# Altium schematic sheet board.SchDoc
size A4
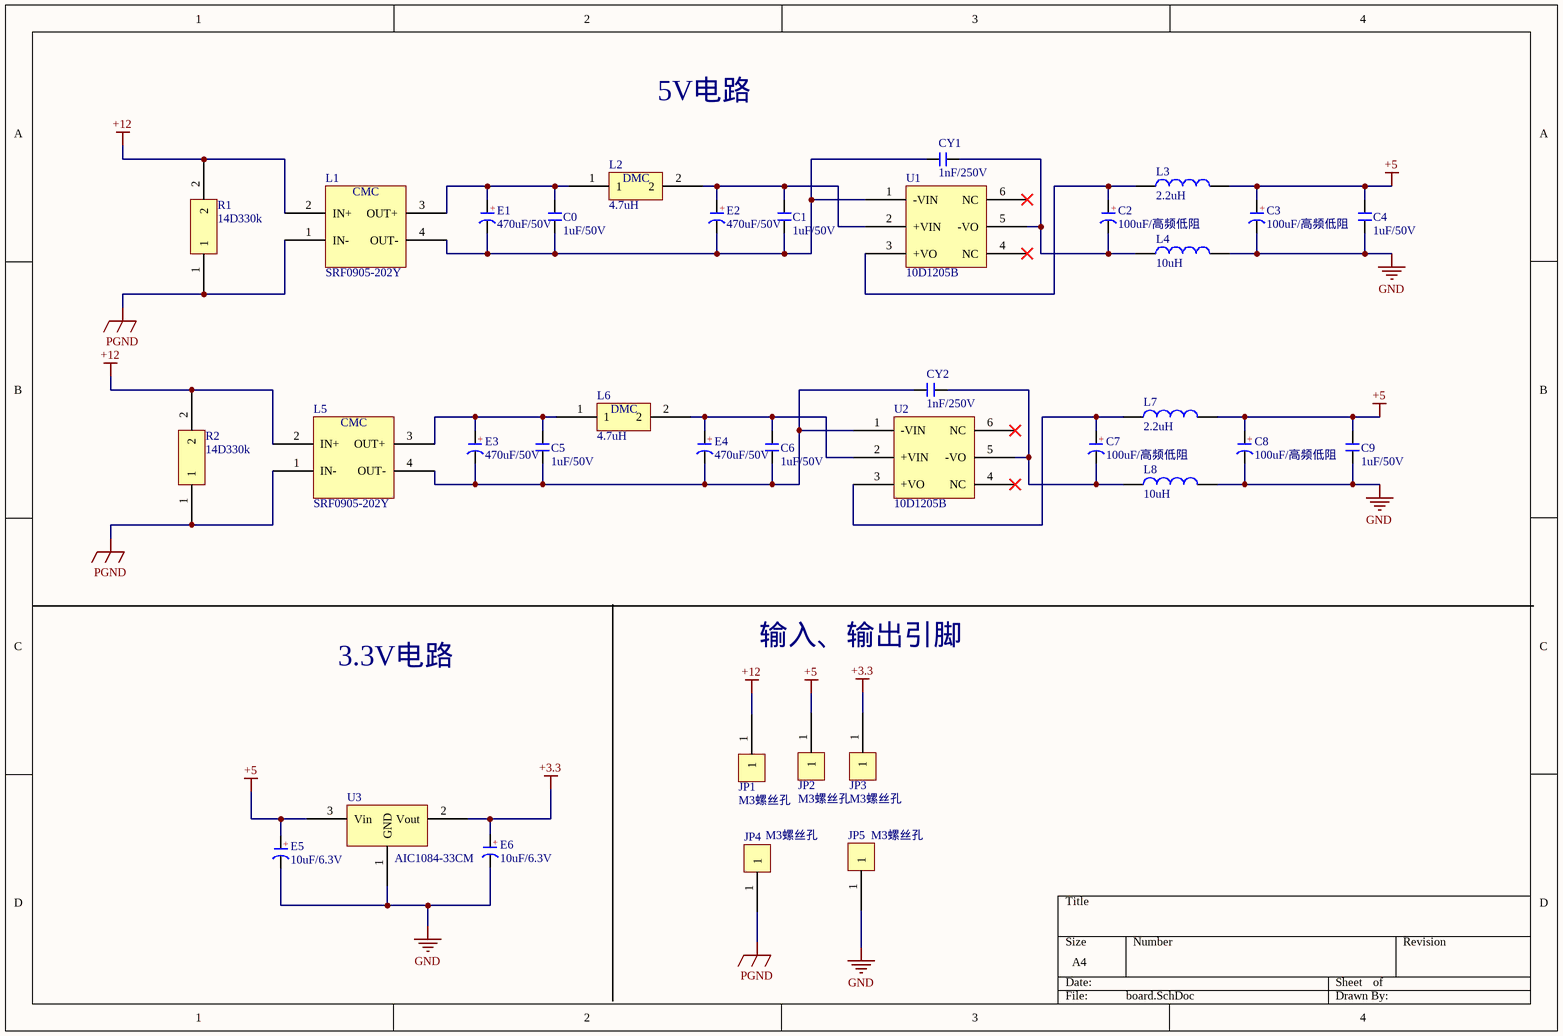
[diagram p0: board.SchDoc]

## Parts
C0  1uF/50V  [CC 2.2*5]
C1  1uF/50V  [CC 2.2*5]
C2  100uF/高频低阻  [CAP 3.5*8*11.5-H - GD]
C3  100uF/高频低阻  [CAP 3.5*8*11.5-H - GD]
C4  1uF/50V  [CC 2.2*5]
C5  1uF/50V  [CC 2.2*5]
C6  1uF/50V  [CC 2.2*5]
C7  100uF/高频低阻  [CAP 3.5*8*11.5-H - GD]
C8  100uF/高频低阻  [CAP 3.5*8*11.5-H - GD]
C9  1uF/50V  [CC 2.2*5]
CY1  1nF/250V  [CY 7.5*10*4]
CY2  1nF/250V  [CY 7.5*10*4]
E1  470uF/50V  [CM G(12.5*13.5)]
E2  470uF/50V  [CM G(12.5*13.5)]
E3  470uF/50V  [CM G(12.5*13.5)]
E4  470uF/50V  [CM G(12.5*13.5)]
E5  10uF/6.3V  [CD A(3216)]
E6  10uF/6.3V  [CD A(3216)]
JP1  M3螺丝孔  [M3x15_N]
JP2  M3螺丝孔  [M3x15_N]
JP3  M3螺丝孔  [M3x15_N]
JP4  M3螺丝孔  [M3x15_N]
JP5  M3螺丝孔  [M3x15_N]
L1  SRF0905-202Y  [SRF0905]
L2  4.7uH  [NR5020]
L3  2.2uH  [L 0805]
L4  10uH  [L 0805]
L5  SRF0905-202Y  [SRF0905]
L6  4.7uH  [NR5020]
L7  2.2uH  [L 0805]
L8  10uH  [L 0805]
R1  14D330k  [14D330k]
R2  14D330k  [14D330k]
U1  10D1205B  [10D1205B]
U2  10D1205B  [10D1205B]
U3  AIC1084-33CM  [TO263-3B]

## Nets
+3.3: E6.1(A) JP3.1 U3.2(Vout)
+5: C3.1(A) C4.1 C8.1(A) C9.1 E5.1(A) JP2.1 L3.2 L7.2 U3.3(Vin)
+12: JP1.1 L1.2(IN+) L5.2(IN+) R1.2 R2.2
GND: C3.2(K) C4.2 C8.2(K) C9.2 E5.2(K) E6.2(K) JP5.1 L4.2 L8.2 U3.1(GND)
PGND: JP4.1 L1.1(IN-) L5.1(IN-) R1.1 R2.1
NetC0_1: C0.1 E1.1(A) L1.3(OUT+) L2.1
NetC0_2: C0.2 C1.2 CY1.1 E1.2(K) E2.2(K) L1.4(OUT-) U1.1(-VIN)
NetC1_1: C1.1 E2.1(A) L2.2 U1.2(+VIN)
NetC2_1: C2.1(A) L3.1 U1.3(+VO)
NetC2_2: C2.2(K) CY1.2 L4.1 U1.5(-VO)
NetC5_1: C5.1 E3.1(A) L5.3(OUT+) L6.1
NetC5_2: C5.2 C6.2 CY2.1 E3.2(K) E4.2(K) L5.4(OUT-) U2.1(-VIN)
NetC6_1: C6.1 E4.1(A) L6.2 U2.2(+VIN)
NetC7_1: C7.1(A) L7.1 U2.3(+VO)
NetC7_2: C7.2(K) CY2.2 L8.1 U2.5(-VO)

Not connected (* = marked no-connect by the designer): U1 4(NC)* 6(NC)*; U2 4(NC)* 6(NC)*

## Notes on the sheet
- 5V电路
- 输入、输出引脚
- 3.3V电路
- (in symbol C-CAP) +
- (in symbol C-CD) +
- (in symbol C-CM) +
- (in symbol DML-5020) DMC
- (in symbol SRF0905-202Y) CMC

## Library data of the parts
C0 C1 C4-C6 C9 = C-CC: 直插瓷片电容; 版权归属: 源创客; BOM名称: 直插瓷片电容; 学习资源: www.ooocke.com
C2 C3 C7 C8 = C-CAP: 直插电解电容; 版权归属: 源创客; BOM名称: 直插电解电容; 学习资源: www.ooocke.com
CY1 CY2 = C-CY: 高压陶瓷电容，Y电容; 版权归属: 源创客; BOM名称: 高压陶瓷电容，Y电容; 学习资源: www.ooocke.com
E1-E4 = C-CM: 贴片电解电容; 版权归属: 源创客; BOM名称: 贴片电解电容; 学习资源: www.ooocke.com
E5 E6 = C-CD: 贴片钽电容; 版权归属: 源创客; BOM名称: 贴片钽电容; 学习资源: www.ooocke.com
L1 L5 = SRF0905-202Y: 共模电感
L2 L6 = DML-5020: 差模电感
L3 L4 L7 L8 = L: 小功率贴片电感; 版权归属: 源创客; BOM名称: 小功率贴片电感; 学习资源: www.ooocke.com